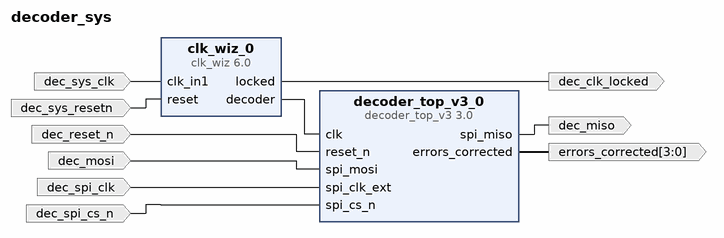
[diagram p0: block diagram of the top level]
# Vivado block design decoder_sys, xc7z020clg484-1, Vivado 2022.1
create_bd_design decoder_sys

create_bd_port -dir I -type clk dec_sys_clk
set_property -dict {CONFIG.FREQ_HZ 100000000} [get_bd_ports dec_sys_clk]
create_bd_port -dir O -type data dec_clk_locked
create_bd_port -dir I -type clk dec_spi_clk
set_property -dict {CONFIG.FREQ_HZ 100000000} [get_bd_ports dec_spi_clk]
create_bd_port -dir I -type data dec_spi_cs_n
create_bd_port -dir I -type data dec_mosi
create_bd_port -dir O -type data dec_miso
create_bd_port -dir O -from 3 -to 0 -type data errors_corrected
create_bd_port -dir I -type rst dec_reset_n
create_bd_port -dir I -type rst dec_sys_resetn
set_property -dict {CONFIG.POLARITY ACTIVE_HIGH} [get_bd_ports dec_sys_resetn]

create_bd_cell -type ip -vlnv xilinx.com:ip:clk_wiz:6.0 clk_wiz_0
set_property -dict [list \
  CONFIG.CLKOUT2_JITTER 175.402 \
  CONFIG.CLKOUT2_PHASE_ERROR 98.575 \
  CONFIG.CLKOUT2_REQUESTED_OUT_FREQ 25.000 \
  CONFIG.CLKOUT2_USED false \
  CONFIG.CLKOUT3_JITTER 175.402 \
  CONFIG.CLKOUT3_PHASE_ERROR 98.575 \
  CONFIG.CLKOUT3_REQUESTED_OUT_FREQ 25.000 \
  CONFIG.CLKOUT3_REQUESTED_PHASE 180.000 \
  CONFIG.CLKOUT3_USED false \
  CONFIG.CLK_OUT1_PORT decoder \
  CONFIG.CLK_OUT2_PORT slave_0 \
  CONFIG.CLK_OUT3_PORT slave_180 \
  CONFIG.MMCM_CLKOUT1_DIVIDE 1 \
  CONFIG.MMCM_CLKOUT2_DIVIDE 1 \
  CONFIG.MMCM_CLKOUT2_PHASE 180.000 \
  CONFIG.NUM_OUT_CLKS 1 \
  CONFIG.PRIM_IN_FREQ 100.000 \
  CONFIG.RESET_PORT reset \
  CONFIG.RESET_TYPE ACTIVE_HIGH \
] [get_bd_cells clk_wiz_0]
create_bd_cell -type ip -vlnv xilinx.com:user:decoder_top_v3:3.0 decoder_top_v3_0
set_property -dict {CONFIG.COMMS_DEBUG true CONFIG.SHIFT_IN_COMP 1} [get_bd_cells decoder_top_v3_0]

# ---- connections ----

connect_bd_net [get_bd_ports dec_reset_n] [get_bd_pins decoder_top_v3_0/reset_n]
connect_bd_net [get_bd_pins clk_wiz_0/decoder] [get_bd_pins decoder_top_v3_0/clk]
connect_bd_net [get_bd_pins clk_wiz_0/locked] [get_bd_ports dec_clk_locked]
connect_bd_net [get_bd_ports dec_mosi] [get_bd_pins decoder_top_v3_0/spi_mosi]
connect_bd_net [get_bd_ports dec_spi_clk] [get_bd_pins decoder_top_v3_0/spi_clk_ext]
connect_bd_net [get_bd_ports dec_spi_cs_n] [get_bd_pins decoder_top_v3_0/spi_cs_n]
connect_bd_net [get_bd_ports dec_sys_clk] [get_bd_pins clk_wiz_0/clk_in1]
connect_bd_net [get_bd_ports dec_sys_resetn] [get_bd_pins clk_wiz_0/reset]
connect_bd_net [get_bd_pins decoder_top_v3_0/errors_corrected] [get_bd_ports errors_corrected]
connect_bd_net [get_bd_pins decoder_top_v3_0/spi_miso] [get_bd_ports dec_miso]

validate_bd_design
save_bd_design
